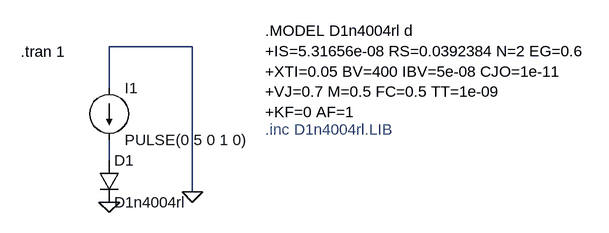
[diagram p0: schematic Import_Example_2.asc]
Import_Example_2.asc, the LTspice schematic file:
Version 4
SHEET 1 928 680
WIRE 272 64 144 64
WIRE 144 128 144 64
WIRE 144 240 144 208
WIRE 272 288 272 64
FLAG 144 304 0
FLAG 272 288 0
SYMBOL current 144 128 R0
WINDOW 123 0 0 Left 0
WINDOW 39 0 0 Left 0
SYMATTR InstName I1
SYMATTR Value PULSE(0 5 0 1 0)
SYMBOL diode 128 240 R0
SYMATTR InstName D1
SYMATTR Value D1n4004rl
TEXT 384 40 Left 2 !.MODEL D1n4004rl d\n+IS=5.31656e-08 RS=0.0392384 N=2 EG=0.6\n+XTI=0.05 BV=400 IBV=5e-08 CJO=1e-11\n+VJ=0.7 M=0.5 FC=0.5 TT=1e-09\n+KF=0 AF=1
TEXT 8 72 Left 2 !.tran 1
TEXT 384 192 Left 2 ;.inc D1n4004rl.LIB

The netlist it stands for:
* Import_Example_2.asc
I1 0 N001 PULSE(0 5 0 1 0)
D1 N001 0 D1n4004rl
.model D D
.lib standard.dio
.MODEL D1n4004rl d
+IS=5.31656e-08 RS=0.0392384 N=2 EG=0.6
+XTI=0.05 BV=400 IBV=5e-08 CJO=1e-11
+VJ=0.7 M=0.5 FC=0.5 TT=1e-09
+KF=0 AF=1
.tran 1
* .inc D1n4004rl.LIB
.backanno
.end